# EAGLE design Schematic (EAGLE 8.4.0)
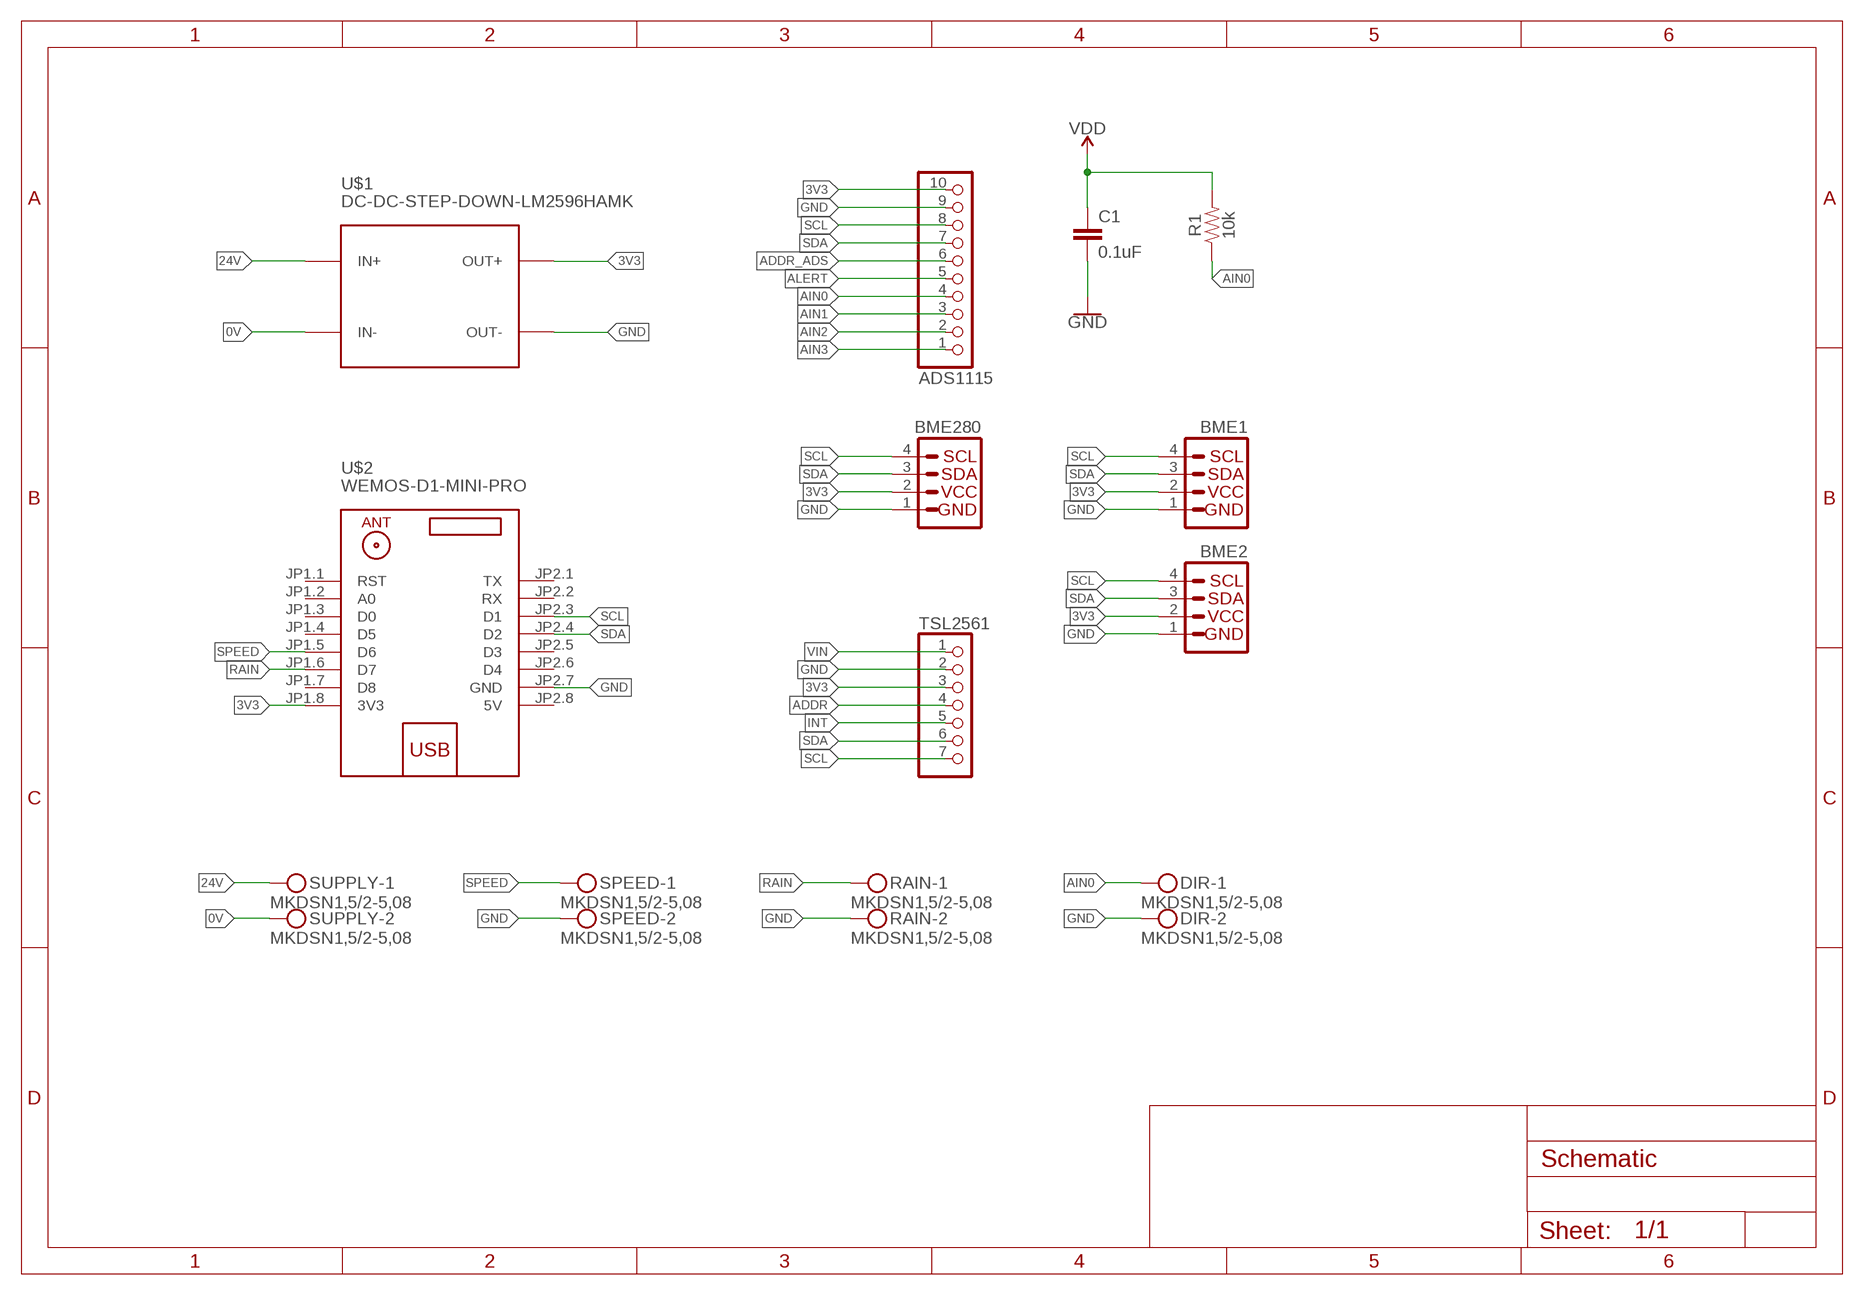
[diagram p0: schematic, sheet 1]

## Parts
ADS1115  HEADER-1X1070MIL  [1X10_ROUND70]
BME1  I2C_STANDARD_NO_SILK  [1X04_NO_SILK]
BME2  I2C_STANDARD_NO_SILK  [1X04_NO_SILK]
BME280  I2C_STANDARD_NO_SILK  [1X04_NO_SILK]
C1  0.1uF  0.1UF-0603-25V-5%  [0603]
DIR  MKDSN1,5/2-5,08  [MKDSN1,5/2-5,08]
R1  10k  10KOHM-0603-1/10W-1%  [0603]
RAIN  MKDSN1,5/2-5,08  [MKDSN1,5/2-5,08]
SPEED  MKDSN1,5/2-5,08  [MKDSN1,5/2-5,08]
SUPPLY  MKDSN1,5/2-5,08  [MKDSN1,5/2-5,08]
TSL2561  HEADER-1X7THICKER  [1X07_ROUND_76]
U$1  DC-DC-STEP-DOWN-LM2596HAMK  [DC-DC-STEP-DOWN-LM2596]
U$2  WEMOS-D1-MINI-PRO  [WEMOS-D1-MINI-PRO]

## Nets
0V: SUPPLY.2 U$1.IN-
3V3: ADS1115.10 BME1.2 BME2.2 BME280.2 C1.1 R1.2 TSL2561.3 U$1.OUT+ U$2.JP1.8(3V3) ; supply symbol labelled VDD
24V: SUPPLY.1 U$1.IN+
ADDR: TSL2561.4
ADDR_ADS: ADS1115.6
AIN0: ADS1115.4 DIR.1 R1.1
AIN1: ADS1115.3
AIN2: ADS1115.2
AIN3: ADS1115.1
ALERT: ADS1115.5
GND: ADS1115.9 BME1.1 BME2.1 BME280.1 C1.2 DIR.2 RAIN.2 SPEED.2 TSL2561.2 U$1.OUT- U$2.JP2.7(GND)
INT: TSL2561.5
RAIN: RAIN.1 U$2.JP1.6(D7)
SCL: ADS1115.8 BME1.4 BME2.4 BME280.4 TSL2561.7 U$2.JP2.3(D1)
SDA: ADS1115.7 BME1.3 BME2.3 BME280.3 TSL2561.6 U$2.JP2.4(D2)
SPEED: SPEED.1 U$2.JP1.5(D6)
VIN: TSL2561.1
Unconnected: U$2.JP1.1(RST) U$2.JP1.2(A0) U$2.JP1.3(D0) U$2.JP1.4(D5) U$2.JP1.7(D8) U$2.JP2.1(TX) U$2.JP2.2(RX) U$2.JP2.5(D3) U$2.JP2.6(D4)

## Power pins joined to a net without a drawn wire
5V: U$2.JP2.8(5V)

## Library data of the parts
ADS1115 = microbuilder:HEADER-1X10: PIN HEADER
BME1 BME2 BME280 = SparkFun-Connectors:I2C_STANDARD: SparkFun has standardized on a pinout for all I2C based sensor breakouts. This pinout allows I2C boards to be plugged directly into the headers on Arduino Uno compatible boards, and to be daisy chained easily.
C1 = SparkFun-Capacitors:0.1UF: 0.1µF ceramic capacitors A capacitor is a passive two-terminal electrical component used to store electrical energy temporarily in an electric field.; PROD_ID: CAP-08604
DIR RAIN SPEED SUPPLY = con-phoenix-508:MKDSN1,5/2-5,08: MKDSN 1,5/ 2-5,08 Printklemme Nennstrom: 13,5 A Nennspannung: 250 V Rastermaß: 5,08 mm Polzahl: 2 Anschlussart: Schraubanschluss Montage: Löten Anschlussrichtung Leiter/Platine: 0 ° Artikelnummer: 1729128 Source: http://eshop.phoenixcontact.com .. 1729128.pdf
R1 = SparkFun-Resistors:10KOHM: 10kΩ resistor A resistor is a passive two-terminal electrical component that implements electrical resistance as a circuit element. Resistors act to reduce current flow, and, at the same time, act to lower voltage levels within circuits. - Wikipedia; PROD_ID: RES-00824
TSL2561 = microbuilder:HEADER-1X7: PIN HEADER
U$1 = diy-modules:DC-DC-STEP-DOWN-LM2596: DC/DC Step-Down Regulator based on LM2596-ADJ chip LM2596 datasheet available here: http://www.ti.com/lit/ds/symlink/lm2596.pdf Click here to find device on ebay.com <http://www.ebay.com/sch/lm2596+power+regulator>
U$2 = diy-modules:WEMOS-D1-MINI-PRO: WEMOS D1 mini Pro: Mini Wi-Fi Board based on ESP-8266EX chip More details can be found here: https://www.wemos.cc/product/d1-mini-pro.html Click here to find device on ebay.com <http://www.ebay.com/sch/wemos+d1+mini+pro>

## Net classes
0 default: width 1.27 mm, clearance 0.508 mm

## Board
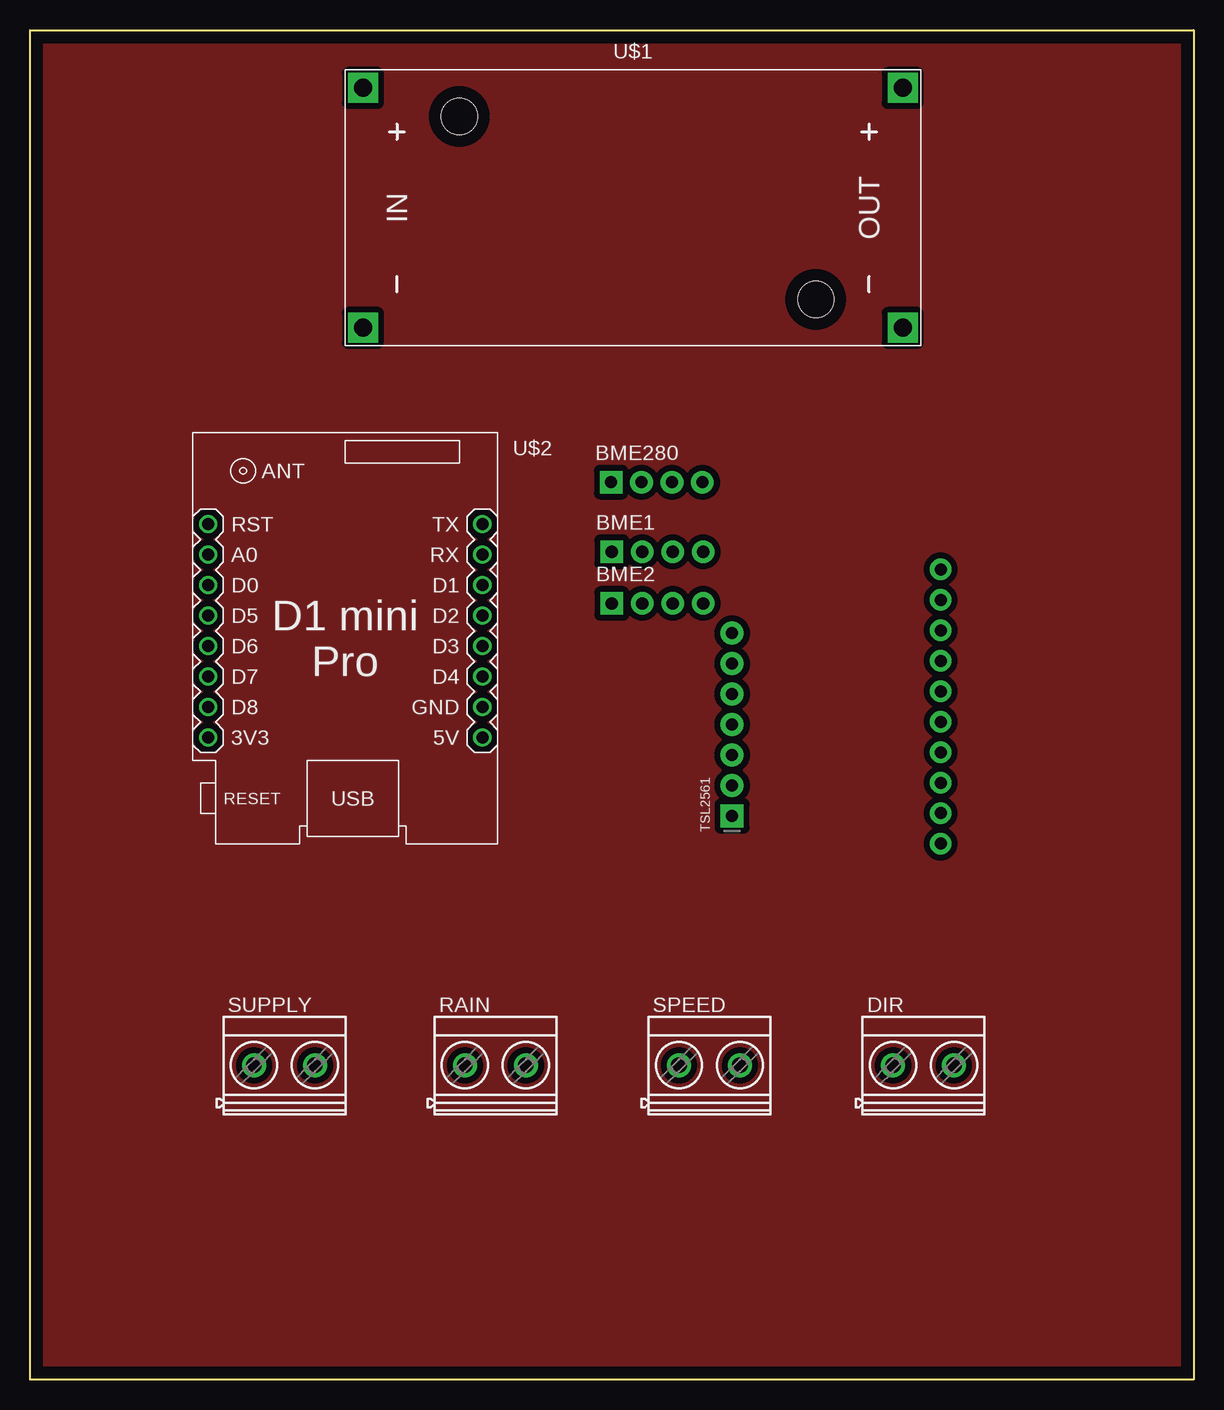
[diagram p1: board, top side]
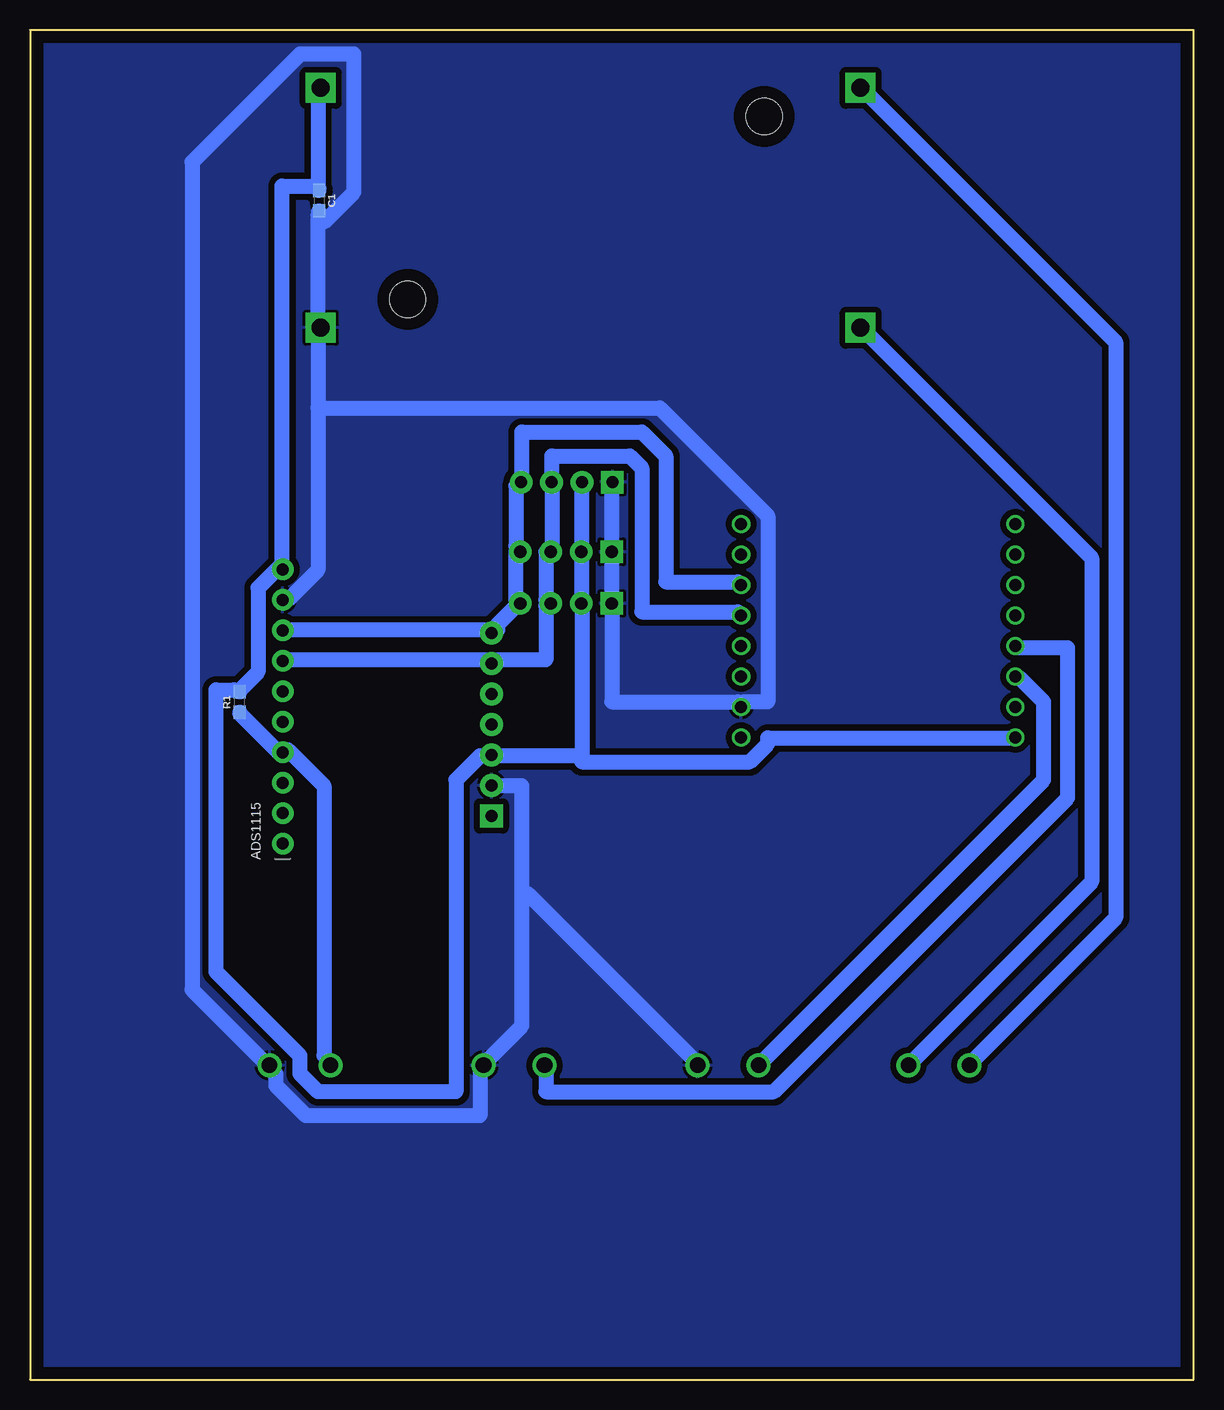
[diagram p2: board, bottom side, seen from below]

Size 97 x 112.5 mm. Coordinates in mm from the lower left corner, seen from the top.
Outline: 0,0 0,112.5 97,112.5 97,0 0,0
Copper layers (1*16): Top 0.035mm / dielectric 1.5mm / Bottom 0.035mm
Design rules "default": minimum track width 6mil, minimum drill 0.35mm, track to track 6mil, track to pad 6mil, pad to pad 6mil, via to via 6mil, smd to smd 6mil, copper to edge 40mil, drill to drill 6mil, minimum pad ring 10mil, minimum via ring 8mil, stop-mask expansion 4mil, vias tented up to drill 0mil, thermal gap 10mil

### Footprints (pad centres in the part's own frame; a part is rotated, then mirrored left to right if it is on the bottom)
1X10_ROUND70 = drill 1 pad 1.778: 1 -11.43,0; 2 -8.89,0; 3 -6.35,0; 4 -3.81,0; 5 -1.27,0; 6 1.27,0; 7 3.81,0; 8 6.35,0; 9 8.89,0; 10 11.43,0
1X04_NO_SILK = drill 1.016 pad 1.88 square: 1 0,0 | drill 1.016 pad 1.88: 2 2.54,0; 3 5.08,0; 4 7.62,0
0603 = smd 1.1 x 1: 1 -0.85,0; 2 0.85,0
MKDSN1,5/2-5,08 = drill 1.3 pad 2: 1 -2.561,0.025; 2 2.519,0.025
1X07_ROUND_76 = drill 1 pad 1.93 square: 1 -7.62,0 | drill 1 pad 1.93: 2 -5.08,0; 3 -2.54,0; 4 0,0; 5 2.54,0; 6 5.08,0; 7 7.62,0
DC-DC-STEP-DOWN-LM2596 = drill 1.5 pad 2.5 square: IN+ -22.5,10; IN- -22.5,-10; OUT+ 22.5,10; OUT- 22.5,-10 | hole 3: -14.478,7.62; 15.24,-7.62
WEMOS-D1-MINI-PRO = drill 1: JP1.1 -11.43,9.525; JP1.2 -11.43,6.985; JP1.3 -11.43,4.445; JP1.4 -11.43,1.905; JP1.5 -11.43,-0.635; JP1.6 -11.43,-3.175; JP1.7 -11.43,-5.715; JP1.8 -11.43,-8.255; JP2.1 11.43,9.525; JP2.2 11.43,6.985; JP2.3 11.43,4.445; JP2.4 11.43,1.905; JP2.5 11.43,-0.635; JP2.6 11.43,-3.175; JP2.7 11.43,-5.715; JP2.8 11.43,-8.255

### Placement (x,y rotation side)
ADS1115  75.93,56.1 90 bottom
BME1  48.5,69 0 top
BME2  48.5,64.7 0 top
BME280  48.44,74.8 0 top
C1  72.91,98.28 270 bottom
DIR  74.51,26.17 0 top
R1  79.52,56.48 90 bottom
RAIN  38.82,26.17 0 top
SPEED  56.67,26.17 0 top
SUPPLY  21.24,26.17 0 top
TSL2561  58.53,54.6 90 top
U$1  50.27,97.67 0 top
U$2  26.28,61.78 0 top

### Tracks (layer width: path | path; a pad name or v marks a point on that pad's centre or on a via)
0V
  Bottom 1.27: SUPPLY.2 23.5,26.5 8.5,41.5 8.5,68.5 27.5,87.5 U$1.IN-
3V3
  Bottom 1.27: 73,99.5 73,107.5 U$1.OUT+ | 73,99.5 C1.1 | 76,68 78,66 78,59 79.5,57.5 R1.2 80,57.5 81.5,57.5 81.5,34 74.5,27 74.5,25.5 73,24 61.5,24 61.5,50 59.5,52 59,52 TSL2561.3 58.5,52 51,52 | 76,68 ADS1115.10 | 73,99.5 76,99.5 76,68 | 51,52 51,64.5 BME2.2 51,65 51,69 BME1.2 51,69.5 51,74.5 BME280.2 | 51,52 51,51.5 37,51.5 35.5,53 35.5,53.5 15,53.5 U$2.JP1.8
24V
  Bottom 1.27: SUPPLY.1 18.5,26.5 6.5,38.5 6.5,86.5 27.5,107.5 U$1.IN+
AIN0
  Bottom 1.27: R1.1 79.5,55.5 76,52 ADS1115.4 75.5,52.5 72.5,49.5 72.5,27 72,26.5 DIR.1
GND
  Bottom 1.27: 56,40.5 56,29.5 59,26.5 SPEED.2 59.5,26 59.5,22 74,22 76.5,24.5 76.5,25.5 77,26 DIR.2 77.5,26.5 83.5,32.5 83.5,101.5 74.5,110.5 70,110.5 70,99 72.5,96.5 73,96.5 | 56,40.5 56,49.5 58.5,49.5 TSL2561.2 | RAIN.2 41.5,26.5 55.5,40.5 56,40.5 | BME280.1 48.5,74.5 BME1.1 BME2.1 48.5,56.5 38,56.5 U$2.JP2.7 37.5,56.5 35.5,56.5 35.5,72 44.5,81 73,81 | 73,96.5 73,88 U$1.OUT- 73,87.5 73,81 | 73,96.5 73,97 C1.2 | 73,81 73,67.5 75.5,65 ADS1115.9
  pour Bottom: 0,0 0,112.5 97,112.5 97,0
  pour Bottom: 0,112.5 97,112.5 97,0 0,0
RAIN
  Bottom 1.27: U$2.JP1.6 14.5,58.5 12.5,56.5 12.5,50 36,26.5 RAIN.1
S$1
  pour Top: 0,0 0,112.5 97,112.5 97,0
SCL
  Bottom 1.27: ADS1115.8 75.5,62.5 59,62.5 TSL2561.7 58,62.5 58,63 56.5,64.5 BME2.4 56.5,65 56.5,69 BME1.4 56.5,69.5 56.5,74.5 BME280.4 56,75 56,79 46,79 44,77 44,66.5 38,66.5 U$2.JP2.3
SDA
  Bottom 1.27: ADS1115.7 75.5,60 59,60 TSL2561.6 58,60 54,60 54,64.5 BME2.3 54,65 54,69 BME1.3 53.5,69.5 53.5,74.5 BME280.3 53.5,75 53.5,77 47,77 46,76 46,64 38,64 U$2.JP2.4
SPEED
  Bottom 1.27: U$2.JP1.5 14.5,61 10.5,61 10.5,48.5 35,24 54,24 54,26 SPEED.1